# Altium project MB1168.PrjPCB (part 1 of 2)
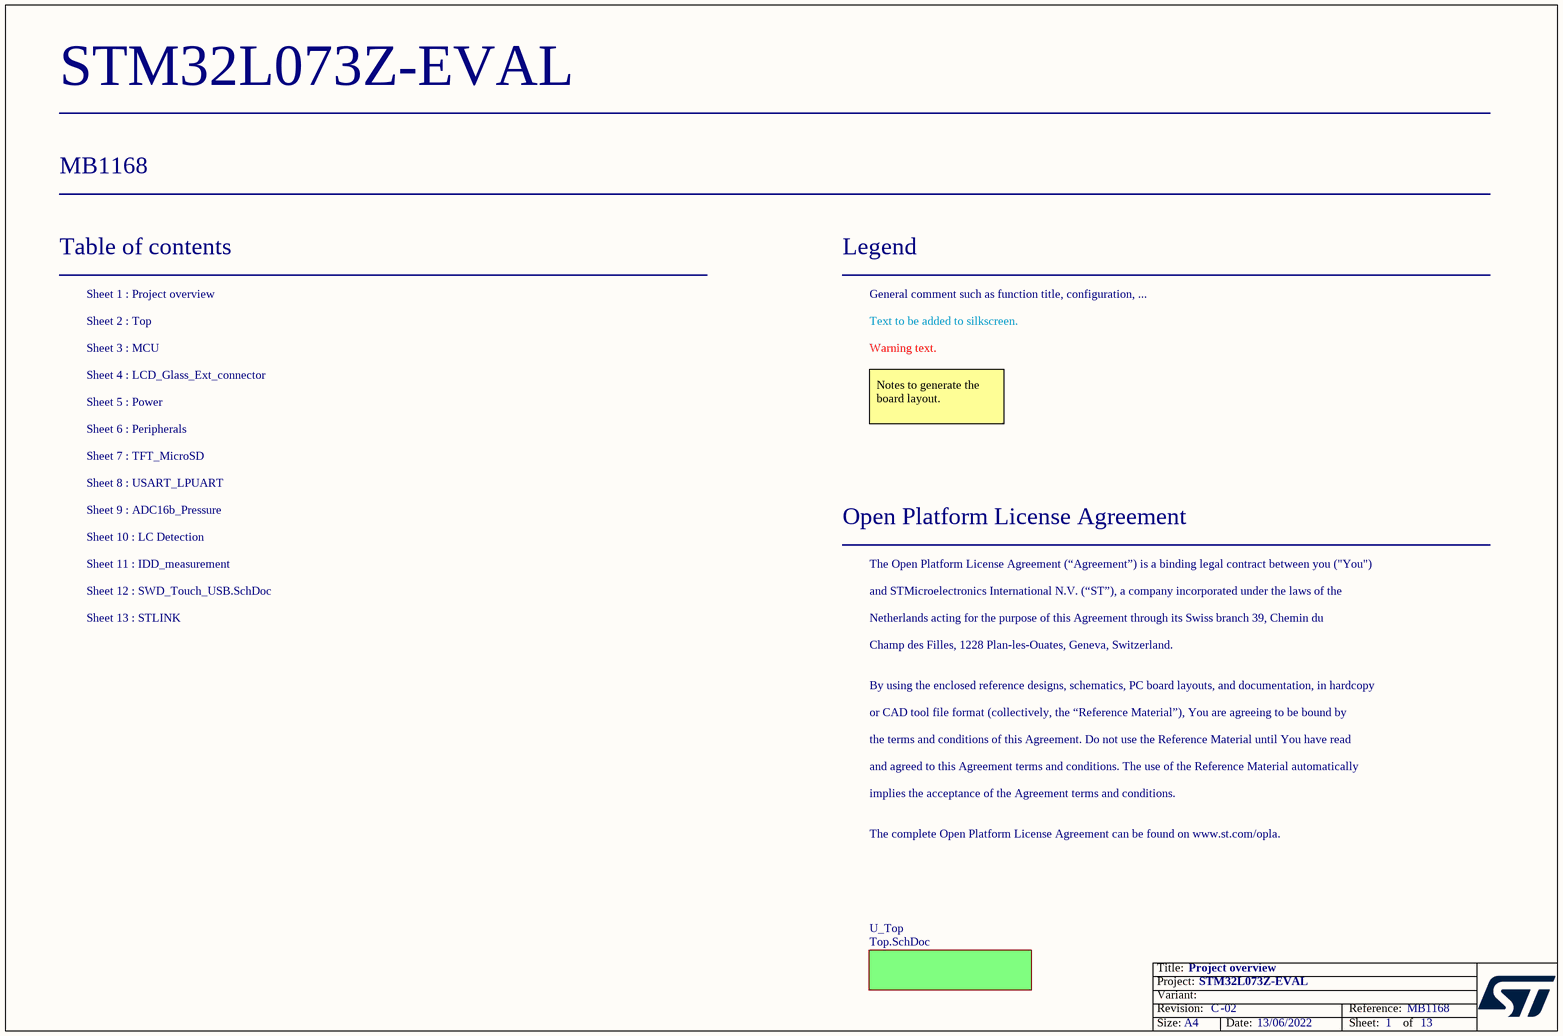
[diagram p0: Project_Overview.SchDoc]
Board_Assembly_Revision: 02; Board_Document_Date: 13/06/2022; Board_Name: STM32L073Z-EVAL; Board_PCB_Revision: C; Board_Reference: MB1168
6 sheets, 267 parts. Net scope: flat (ports and power ports of the same name join across sheets).
Sheets:
  Project_Overview.SchDoc
    U_Top = Top.SchDoc
      U_MCU = MCU.SchDoc
      U_IDD_measurement = IDD_measurement.SchDoc
      U_Power = Power.SchDoc
      U_USART_LPUART = USART_LPUART.SchDoc

## Sheet Project_Overview.SchDoc: Project overview
size A4; Date: Not used; ApprovedBy: Not used; CheckedBy: Not used; Author: Not used; CompanyName: STMicroelectronics; DrawnBy: Not used; Engineer: Not used; Organization: Not used; Address1: Not used; Address2: Not used; Address3: Not used; Address4: Not used; DocumentNumber: 13; Revision: Not used; SheetNumber: 1; SheetTotal: 13; CurrentTime: Not used; CurrentDate: Not used; Time: Not used; DocumentFullPathAndName: Not used; DocumentName: Not used; ModifiedDate: Not used; ImagePath: Not used; ProjectName: Not used; Application_BuildNumber: Not used

### Sub-sheets
U_Top = Top.SchDoc: no entries

### Notes on the sheet
- STM32L073Z-EVAL
- MB1168
- Table of contents
- Sheet 1 : Project overview
- Legend
- General comment such as function title, configuration, ...
- Sheet 2 : Top
- Sheet 3 : MCU
- Sheet 4 : LCD_Glass_Ext_connector
- Text to be added to silkscreen.
- Warning text.
- Sheet 6 : Peripherals
- Sheet 5 : Power
- Notes to generate the board layout.
- Sheet 7 : TFT_MicroSD
- Sheet 8 : USART_LPUART
- Sheet 9 : ADC16b_Pressure
- Sheet 10 : LC Detection
- Sheet 11 : IDD_measurement
- Open Platform License Agreement
- The Open Platform License Agreement (“Agreement”) is a binding legal contract between you ("You")
- Sheet 12 : SWD_Touch_USB.SchDoc
- Sheet 13 : STLINK
- and STMicroelectronics International N.V. (“ST”), a company incorporated under the laws of the
- Netherlands acting for the purpose of this Agreement through its Swiss branch 39, Chemin du
- Champ des Filles, 1228 Plan-les-Ouates, Geneva, Switzerland.
- By using the enclosed reference designs, schematics, PC board layouts, and documentation, in hardcopy
- or CAD tool file format (collectively, the “Reference Material”), You are agreeing to be bound by
- the terms and conditions of this Agreement. Do not use the Reference Material until You have read
- and agreed to this Agreement terms and conditions. The use of the Reference Material automatically
- implies the acceptance of the Agreement terms and conditions.
- The complete Open Platform License Agreement can be found on www.st.com/opla.
- Title:
- Project:
- Size:
- Revision:
- Variant:
- A4
- -
- Date:
- Reference:
- Sheet:
- of

## Sheet Top.SchDoc: Top
size A3; Project: STM32L073Z-EVAL; Date: Not used; ApprovedBy: Not used; CheckedBy: Not used; Author: Not used; CompanyName: STMicroelectronics; DrawnBy: Not used; Engineer: Not used; Organization: Not used; Address1: Not used; Address2: Not used; Address3: Not used; Address4: Not used; DocumentNumber: 1; Revision: Not used; SheetNumber: 2; SheetTotal: 13; CurrentTime: Not used; CurrentDate: Not used; Time: Not used; DocumentFullPathAndName: Not used; DocumentName: Not used; ModifiedDate: Not used; ImagePath: Not used; ProjectName: Not used; Application_BuildNumber: Not used
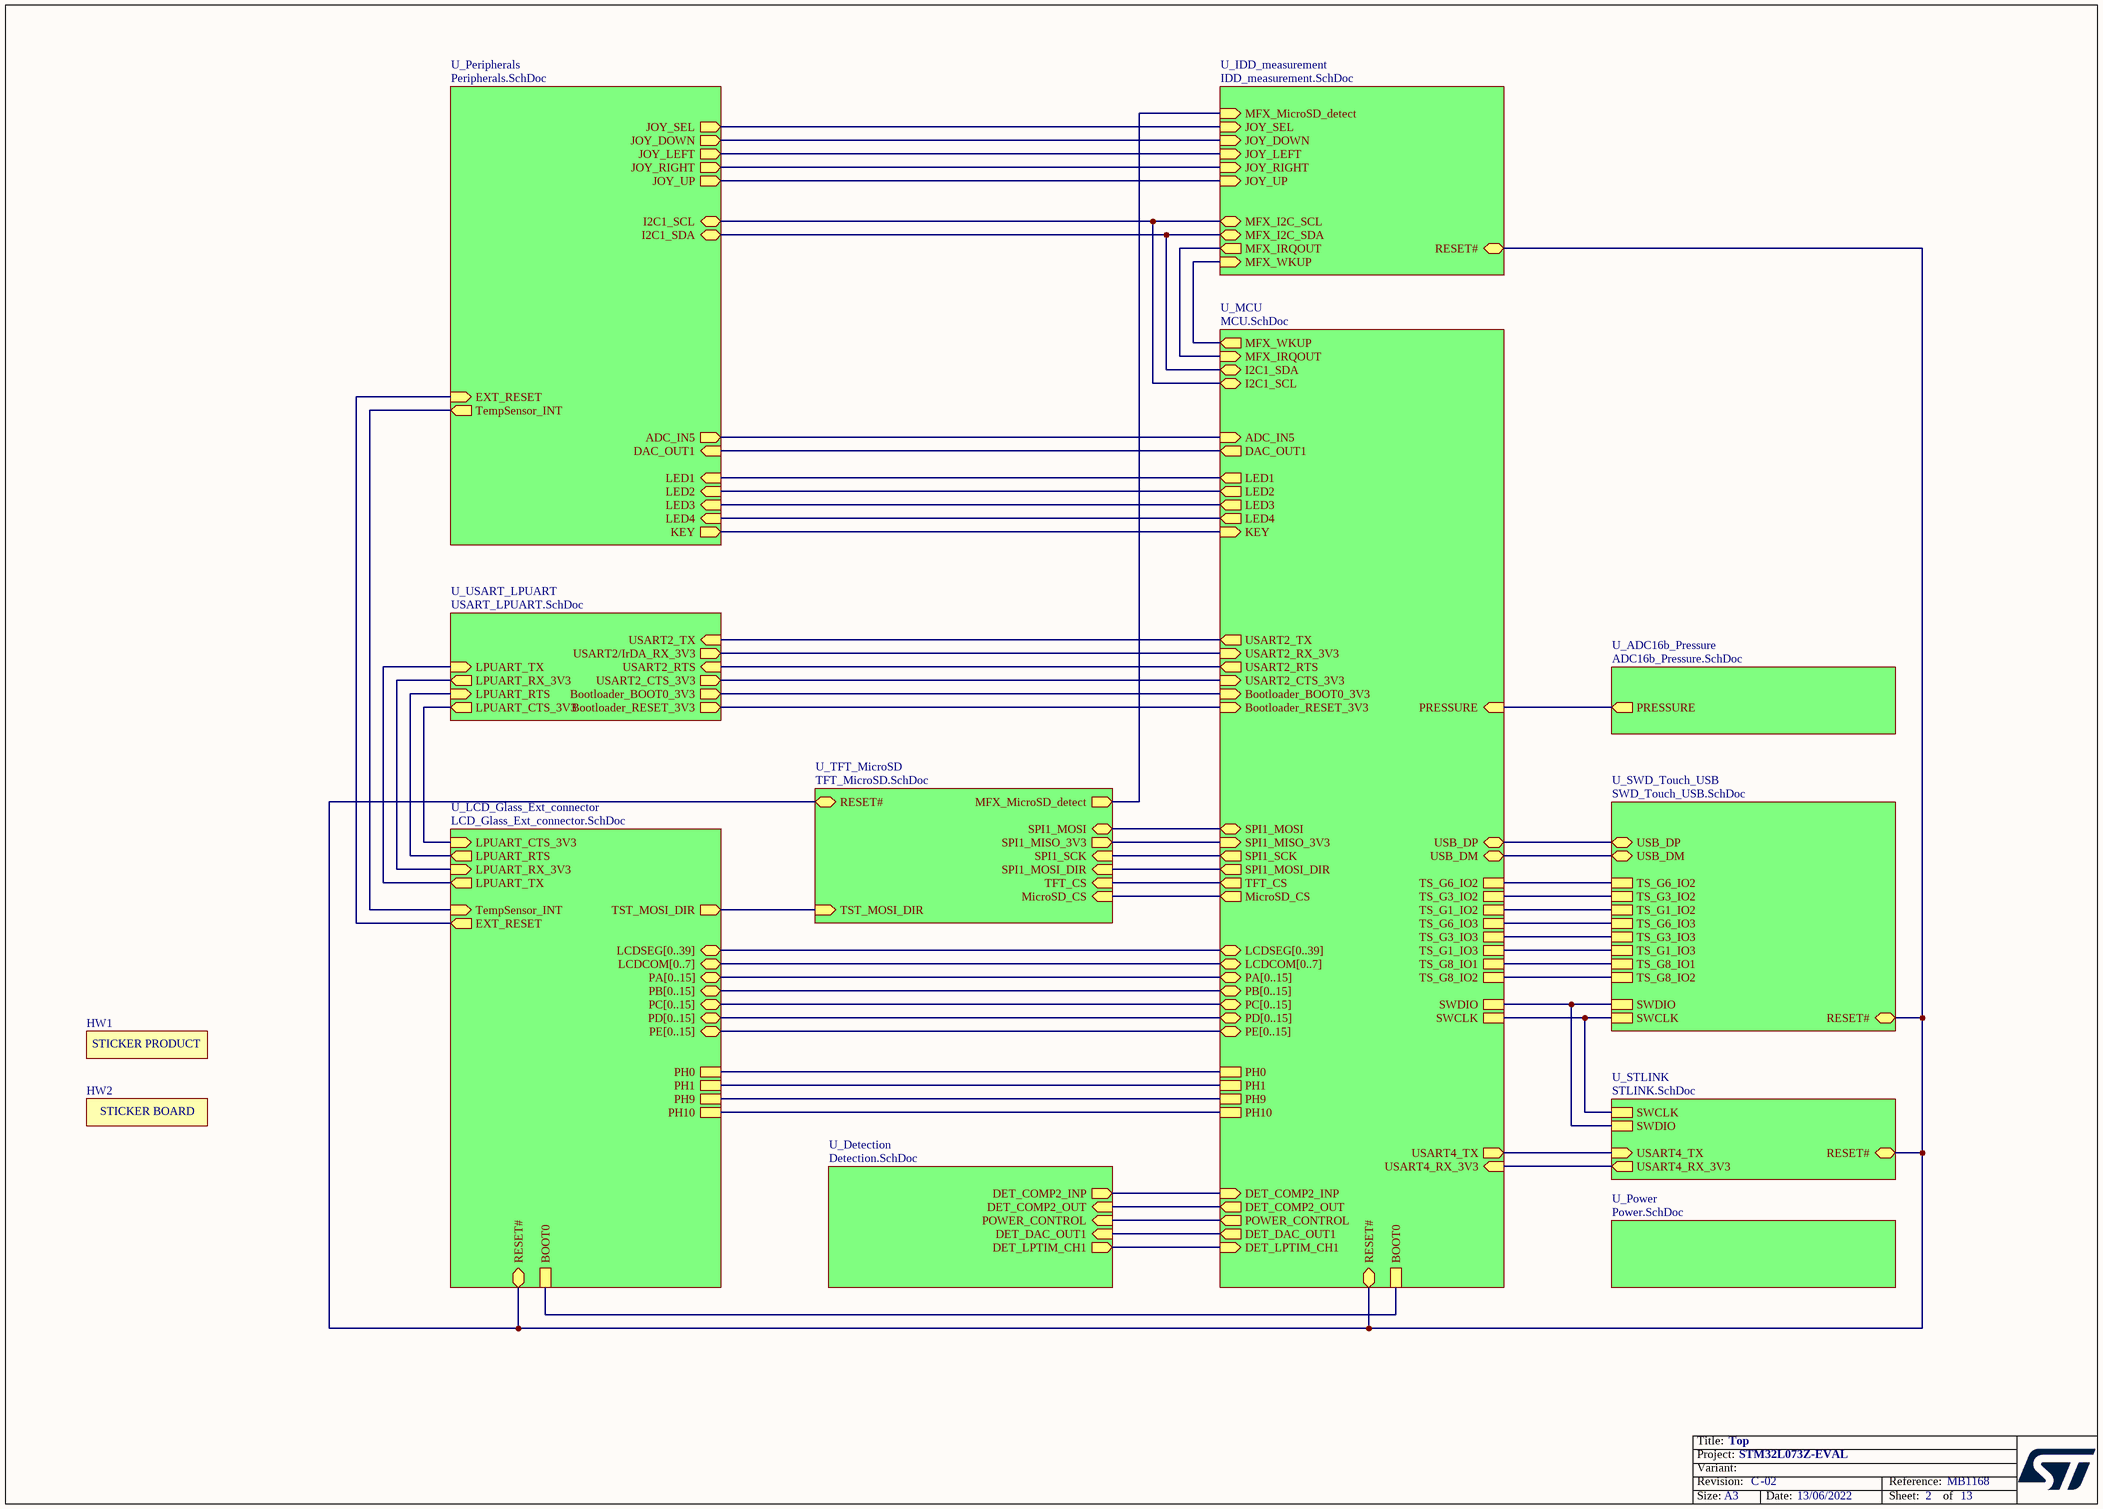
[diagram p1: Top.SchDoc]

### Parts
HW1  STICKER_PRODUCT  (value not drawn)  (no BOM)
HW2  STICKER_BOARD  (value not drawn)  (no BOM)

### Sub-sheets
U_ADC16b_Pressure = ADC16b_Pressure.SchDoc (file not in this document): PRESSURE (out)
U_Detection = Detection.SchDoc (file not in this document): DET_COMP2_INP (out), DET_COMP2_OUT (in), DET_DAC_OUT1 (in), POWER_CONTROL (in), DET_LPTIM_CH1 (out)
U_IDD_measurement = IDD_measurement.SchDoc: MFX_IRQOUT (out), JOY_SEL (in), JOY_DOWN (in), JOY_LEFT (in), JOY_RIGHT (in), JOY_UP (in), MFX_WKUP (in), MFX_MicroSD_detect (in), RESET# (bidir), MFX_I2C_SDA (bidir), MFX_I2C_SCL (bidir)
U_LCD_Glass_Ext_connector = LCD_Glass_Ext_connector.SchDoc (file not in this document): LCDSEG[0..39] (bidir), LCDCOM[0..7] (bidir), LPUART_RX_3V3 (in), LPUART_TX (out), LPUART_CTS_3V3 (in), LPUART_RTS (out), TST_MOSI_DIR (out), TempSensor_INT (in), EXT_RESET (out), PA[0..15] (bidir), PB[0..15] (bidir), PC[0..15] (bidir), PD[0..15] (bidir), PE[0..15] (bidir), RESET# (bidir), PH1, PH0, BOOT0, PH10, PH9
U_MCU = MCU.SchDoc: I2C1_SDA (bidir), I2C1_SCL (bidir), MFX_IRQOUT (in), Bootloader_BOOT0_3V3 (in), Bootloader_RESET_3V3 (in), BOOT0, USART2_RX_3V3 (in), USART2_CTS_3V3 (in), USART2_TX (out), USART2_RTS (out), SPI1_SCK (out), SPI1_MOSI (bidir), MicroSD_CS (out), TFT_CS (out), KEY (in), LED4 (out), LED3 (out), LED1 (out), LED2 (out), USART4_RX_3V3 (in), USART4_TX (out), PRESSURE (in), TS_G1_IO2, TS_G1_IO3, DAC_OUT1 (out), TS_G3_IO2, TS_G3_IO3, TS_G6_IO2, TS_G6_IO3, ADC_IN5 (in), USB_DM (bidir), USB_DP (bidir), SWDIO, SWCLK, SPI1_MISO_3V3 (in), DET_DAC_OUT1 (out), SPI1_MOSI_DIR (out), LCDSEG[0..39] (bidir), LCDCOM[0..7] (bidir), PA[0..15] (bidir), PB[0..15] (bidir), PC[0..15] (bidir), PD[0..15] (bidir), PE[0..15] (bidir), RESET# (bidir), PH1, PH0, PH10, PH9, MFX_WKUP (out), TS_G8_IO1, TS_G8_IO2, DET_COMP2_INP (in), POWER_CONTROL (out), DET_COMP2_OUT (out), DET_LPTIM_CH1 (in)
U_Peripherals = Peripherals.SchDoc (file not in this document): I2C1_SDA (bidir), TempSensor_INT (out), EXT_RESET (in), JOY_SEL (out), JOY_DOWN (out), JOY_LEFT (out), JOY_RIGHT (out), JOY_UP (out), DAC_OUT1 (in), ADC_IN5 (out), KEY (out), LED4 (in), LED3 (in), LED1 (in), LED2 (in), I2C1_SCL (bidir)
U_Power = Power.SchDoc: no entries
U_STLINK = STLINK.SchDoc (file not in this document): USART4_RX_3V3 (out), USART4_TX (in), SWDIO, SWCLK, RESET# (bidir)
U_SWD_Touch_USB = SWD_Touch_USB.SchDoc (file not in this document): RESET# (bidir), SWDIO, SWCLK, USB_DM (bidir), USB_DP (bidir), TS_G1_IO2, TS_G6_IO2, TS_G3_IO2, TS_G6_IO3, TS_G3_IO3, TS_G1_IO3, TS_G8_IO1, TS_G8_IO2
U_TFT_MicroSD = TFT_MicroSD.SchDoc (file not in this document): MFX_MicroSD_detect (out), RESET# (bidir), SPI1_MISO_3V3 (out), SPI1_MOSI (bidir), SPI1_MOSI_DIR (in), SPI1_SCK (in), MicroSD_CS (in), TFT_CS (in), TST_MOSI_DIR (in)
U_USART_LPUART = USART_LPUART.SchDoc: USART2/IrDA_RX_3V3 (out), Bootloader_BOOT0_3V3 (out), Bootloader_RESET_3V3 (out), USART2_CTS_3V3 (out), USART2_TX (in), USART2_RTS (in), LPUART_RX_3V3 (out), LPUART_CTS_3V3 (out), LPUART_TX (in), LPUART_RTS (in)

### Nets
(unnamed): sheet U_MCU/I2C1_SDA, sheet U_IDD_measurement/MFX_I2C_SDA, sheet U_Peripherals/I2C1_SDA
(unnamed): sheet U_MCU/I2C1_SCL, sheet U_IDD_measurement/MFX_I2C_SCL, sheet U_Peripherals/I2C1_SCL
(unnamed): sheet U_MCU/MFX_IRQOUT, sheet U_IDD_measurement/MFX_IRQOUT
(unnamed): sheet U_MCU/Bootloader_BOOT0_3V3, sheet U_USART_LPUART/Bootloader_BOOT0_3V3
(unnamed): sheet U_MCU/Bootloader_RESET_3V3, sheet U_USART_LPUART/Bootloader_RESET_3V3
(unnamed): sheet U_MCU/BOOT0, sheet U_LCD_Glass_Ext_connector/BOOT0
(unnamed): sheet U_MCU/USART2_RX_3V3, sheet U_USART_LPUART/USART2/IrDA_RX_3V3
(unnamed): sheet U_MCU/USART2_CTS_3V3, sheet U_USART_LPUART/USART2_CTS_3V3
(unnamed): sheet U_MCU/USART2_TX, sheet U_USART_LPUART/USART2_TX
(unnamed): sheet U_MCU/USART2_RTS, sheet U_USART_LPUART/USART2_RTS
(unnamed): sheet U_MCU/SPI1_SCK, sheet U_TFT_MicroSD/SPI1_SCK
(unnamed): sheet U_MCU/SPI1_MOSI, sheet U_TFT_MicroSD/SPI1_MOSI
(unnamed): sheet U_MCU/MicroSD_CS, sheet U_TFT_MicroSD/MicroSD_CS
(unnamed): sheet U_MCU/TFT_CS, sheet U_TFT_MicroSD/TFT_CS
(unnamed): sheet U_MCU/KEY, sheet U_Peripherals/KEY
(unnamed): sheet U_MCU/LED4, sheet U_Peripherals/LED4
(unnamed): sheet U_MCU/LED3, sheet U_Peripherals/LED3
(unnamed): sheet U_MCU/LED1, sheet U_Peripherals/LED1
(unnamed): sheet U_MCU/LED2, sheet U_Peripherals/LED2
(unnamed): sheet U_MCU/USART4_RX_3V3, sheet U_STLINK/USART4_RX_3V3
(unnamed): sheet U_MCU/USART4_TX, sheet U_STLINK/USART4_TX
(unnamed): sheet U_MCU/PRESSURE, sheet U_ADC16b_Pressure/PRESSURE
(unnamed): sheet U_MCU/TS_G1_IO2, sheet U_SWD_Touch_USB/TS_G1_IO2
(unnamed): sheet U_MCU/TS_G1_IO3, sheet U_SWD_Touch_USB/TS_G1_IO3
(unnamed): sheet U_MCU/DAC_OUT1, sheet U_Peripherals/DAC_OUT1
(unnamed): sheet U_MCU/TS_G3_IO2, sheet U_SWD_Touch_USB/TS_G3_IO2
(unnamed): sheet U_MCU/TS_G3_IO3, sheet U_SWD_Touch_USB/TS_G3_IO3
(unnamed): sheet U_MCU/TS_G6_IO2, sheet U_SWD_Touch_USB/TS_G6_IO2
(unnamed): sheet U_MCU/TS_G6_IO3, sheet U_SWD_Touch_USB/TS_G6_IO3
(unnamed): sheet U_MCU/ADC_IN5, sheet U_Peripherals/ADC_IN5
(unnamed): sheet U_MCU/USB_DM, sheet U_SWD_Touch_USB/USB_DM
(unnamed): sheet U_MCU/USB_DP, sheet U_SWD_Touch_USB/USB_DP
(unnamed): sheet U_MCU/SWDIO, sheet U_STLINK/SWDIO, sheet U_SWD_Touch_USB/SWDIO
(unnamed): sheet U_MCU/SWCLK, sheet U_STLINK/SWCLK, sheet U_SWD_Touch_USB/SWCLK
(unnamed): sheet U_MCU/SPI1_MISO_3V3, sheet U_TFT_MicroSD/SPI1_MISO_3V3
(unnamed): sheet U_MCU/DET_DAC_OUT1, sheet U_Detection/DET_DAC_OUT1
(unnamed): sheet U_MCU/SPI1_MOSI_DIR, sheet U_TFT_MicroSD/SPI1_MOSI_DIR
(unnamed): sheet U_MCU/RESET#, sheet U_IDD_measurement/RESET#, sheet U_LCD_Glass_Ext_connector/RESET#, sheet U_STLINK/RESET#, sheet U_TFT_MicroSD/RESET#, sheet U_SWD_Touch_USB/RESET#
(unnamed): sheet U_MCU/PH1, sheet U_LCD_Glass_Ext_connector/PH1
(unnamed): sheet U_MCU/PH0, sheet U_LCD_Glass_Ext_connector/PH0
(unnamed): sheet U_MCU/PH10, sheet U_LCD_Glass_Ext_connector/PH10
(unnamed): sheet U_MCU/PH9, sheet U_LCD_Glass_Ext_connector/PH9
(unnamed): sheet U_MCU/MFX_WKUP, sheet U_IDD_measurement/MFX_WKUP
(unnamed): sheet U_MCU/TS_G8_IO1, sheet U_SWD_Touch_USB/TS_G8_IO1
(unnamed): sheet U_MCU/TS_G8_IO2, sheet U_SWD_Touch_USB/TS_G8_IO2
(unnamed): sheet U_MCU/DET_COMP2_INP, sheet U_Detection/DET_COMP2_INP
(unnamed): sheet U_MCU/POWER_CONTROL, sheet U_Detection/POWER_CONTROL
(unnamed): sheet U_MCU/DET_COMP2_OUT, sheet U_Detection/DET_COMP2_OUT
(unnamed): sheet U_MCU/DET_LPTIM_CH1, sheet U_Detection/DET_LPTIM_CH1
(unnamed): sheet U_IDD_measurement/JOY_SEL, sheet U_Peripherals/JOY_SEL
(unnamed): sheet U_IDD_measurement/JOY_DOWN, sheet U_Peripherals/JOY_DOWN
(unnamed): sheet U_IDD_measurement/JOY_LEFT, sheet U_Peripherals/JOY_LEFT
(unnamed): sheet U_IDD_measurement/JOY_RIGHT, sheet U_Peripherals/JOY_RIGHT
(unnamed): sheet U_IDD_measurement/JOY_UP, sheet U_Peripherals/JOY_UP
(unnamed): sheet U_IDD_measurement/MFX_MicroSD_detect, sheet U_TFT_MicroSD/MFX_MicroSD_detect
(unnamed): sheet U_LCD_Glass_Ext_connector/LPUART_RX_3V3, sheet U_USART_LPUART/LPUART_RX_3V3
(unnamed): sheet U_LCD_Glass_Ext_connector/LPUART_TX, sheet U_USART_LPUART/LPUART_TX
(unnamed): sheet U_LCD_Glass_Ext_connector/LPUART_CTS_3V3, sheet U_USART_LPUART/LPUART_CTS_3V3
(unnamed): sheet U_LCD_Glass_Ext_connector/LPUART_RTS, sheet U_USART_LPUART/LPUART_RTS
(unnamed): sheet U_LCD_Glass_Ext_connector/TST_MOSI_DIR, sheet U_TFT_MicroSD/TST_MOSI_DIR
(unnamed): sheet U_LCD_Glass_Ext_connector/TempSensor_INT, sheet U_Peripherals/TempSensor_INT
(unnamed): sheet U_LCD_Glass_Ext_connector/EXT_RESET, sheet U_Peripherals/EXT_RESET

### Buses and harness runs
bus sheet U_LCD_Glass_Ext_connector/LCDCOM[0..7] = sheet U_MCU/LCDCOM[0..7]
bus sheet U_LCD_Glass_Ext_connector/LCDSEG[0..39] = sheet U_MCU/LCDSEG[0..39]
bus sheet U_LCD_Glass_Ext_connector/PA[0..15] = sheet U_MCU/PA[0..15]
bus sheet U_LCD_Glass_Ext_connector/PB[0..15] = sheet U_MCU/PB[0..15]
bus sheet U_LCD_Glass_Ext_connector/PC[0..15] = sheet U_MCU/PC[0..15]
bus sheet U_LCD_Glass_Ext_connector/PD[0..15] = sheet U_MCU/PD[0..15]
bus sheet U_LCD_Glass_Ext_connector/PE[0..15] = sheet U_MCU/PE[0..15]

### Notes on the sheet
- Title:
- Project:
- Size:
- Revision:
- Variant:
- A3
- -
- Date:
- Reference:
- Sheet:
- of
- (in symbol STICKER_BOARD) STICKER BOARD
- (in symbol STICKER_PRODUCT) STICKER PRODUCT

## Sheet MCU.SchDoc: MCU
size A3; Project: STM32L073Z-EVAL; PageSetup: Record=PageOptions|CenterHorizontal=True|CenterVertical=True|PrintScale=1.00|XCorrection=1.00|YCorrection=1.00|PrintKind=1|BorderSize=5000000|LeftOffset=0|BottomOffset=0|Orientation=2|PaperLength=1000|PaperWidth=1000|Scale=100|PaperSource=7|PrintQuality=-4|MediaType=1|DitherType=10|PaperKind=A3|PrintScaleMode=1; Date: Not used; ApprovedBy: Not used; CheckedBy: Not used; Author: Not used; CompanyName: STMicroelectronics; DrawnBy: Not used; Engineer: Not used; Organization: Not used; Address1: Not used; Address2: Not used; Address3: Not used; Address4: Not used; DocumentNumber: 2; Revision: Not used; SheetNumber: 3; SheetTotal: 13; CurrentTime: Not used; CurrentDate: Not used; Time: Not used; DocumentFullPathAndName: Not used; DocumentName: Not used; ModifiedDate: Not used; ImagePath: Not used; ProjectName: Not used; Application_BuildNumber: Not used
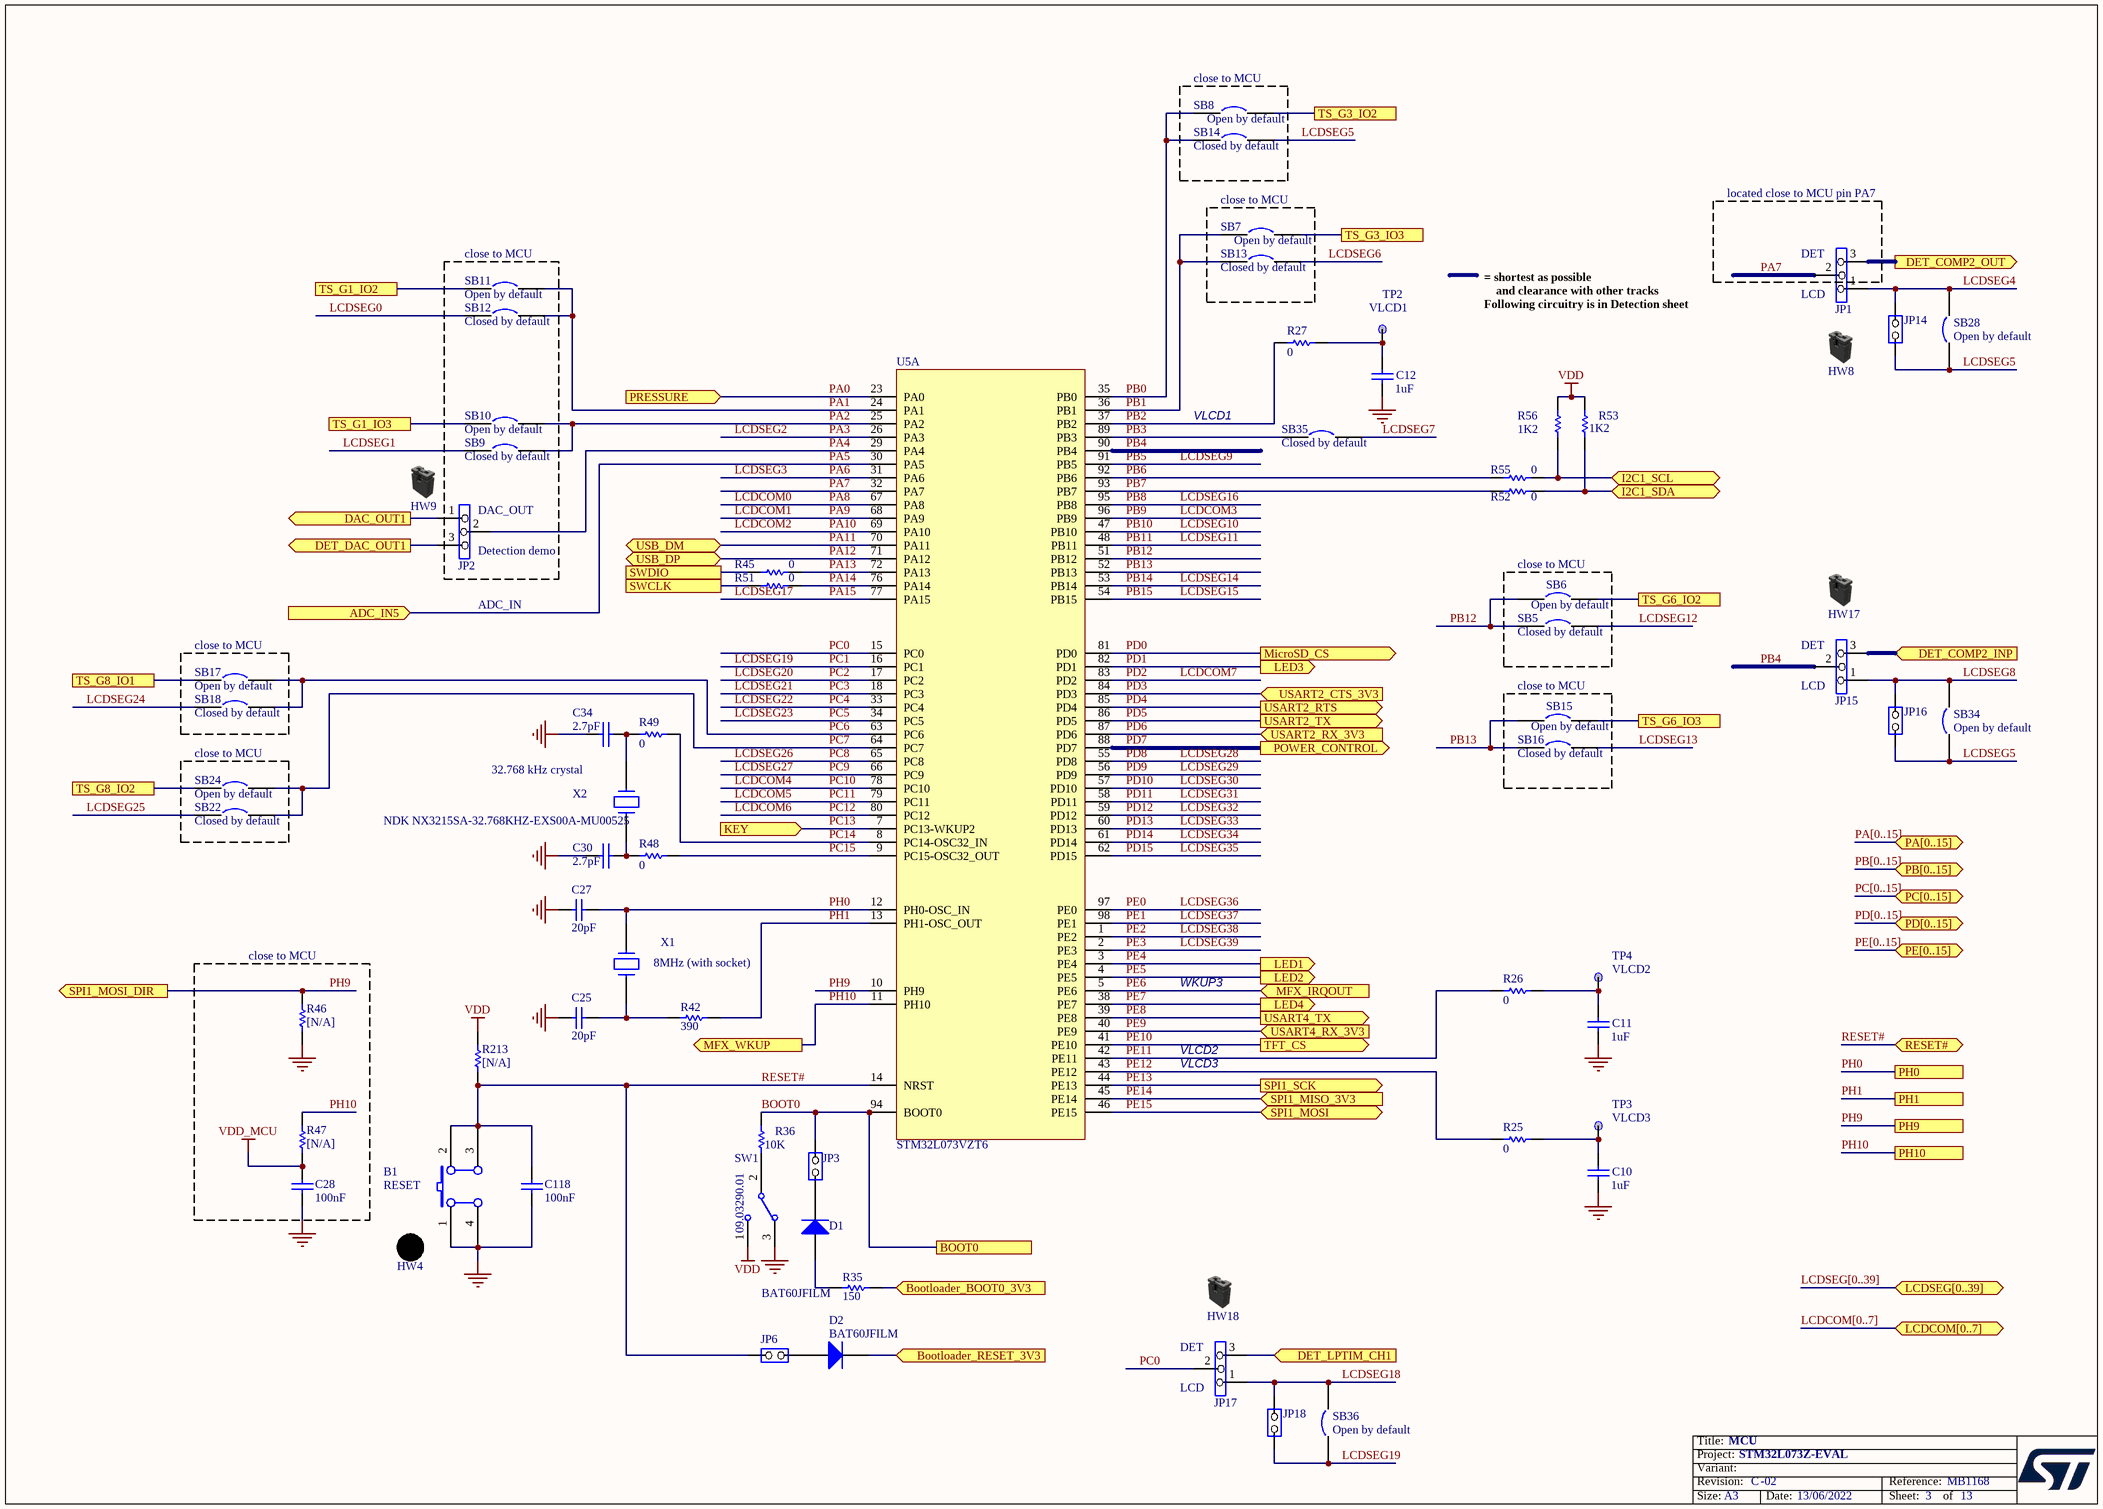
[diagram p2: MCU.SchDoc]

### Parts
B1  RESET  [PB10]
C10  1uF  [0603C]
C11  1uF  [0603C]
C12  1uF  [0603C]
C25  20pF  [0402C]
C27  20pF  [0402C]
C28  100nF  [0402C]
C30  2.7pF  [0603C]
C34  2.7pF  [0603C]
C118  100nF  [0402C]
D1  BAT60JFILM  [SOD-323]
D2  BAT60JFILM  [SOD-323]
HW4  BUTTON_HAT_BLACK  (value not drawn)  (mechanical)
HW8  Shunt Black 2.54mm  (value not drawn)  (mechanical)
HW9  Shunt Black 2.54mm  (value not drawn)  (mechanical)
HW17  Shunt Black 2.54mm  (value not drawn)  (mechanical)
HW18  Shunt Black 2.54mm  (value not drawn)  (mechanical)
JP1  (no value)  [SIP3]
JP2  (no value)  [SIP3]
JP3  (no value)  [SIP2]
JP6  (no value)  [SIP2]
JP14  (no value)  [SIP2]
JP15  (no value)  [SIP3]
JP16  (no value)  [SIP2]
JP17  (no value)  [SIP3]
JP18  (no value)  [SIP2]
R25  0  [0603R]
R26  0  [0603R]
R27  0  [0603R]
R35  150  [0402R]
R36  10K  [0402R]
R42  390  [0603R]
R45  0  [0603R]
R46  [N/A]  [0603R]
R47  [N/A]  [0603R]
R48  0  [0603R]
R49  0  [0603R]
R51  0  [0603R]
R52  0  [0603R]
R53  1K2  [0603R]
R55  0  [0603R]
R56  1K2  [0603R]
R213  [N/A]  [0603R]
SB5  Closed by default  [SB_0603]
SB6  Open by default  [SB_0603]
SB7  Open by default  [SB_0603]
SB8  Open by default  [SB_0603]
SB9  Closed by default  [SB_0603]
SB10  Open by default  [SB_0603]
SB11  Open by default  [SB_0603]
SB12  Closed by default  [SB_0603]
SB13  Closed by default  [SB_0603]
SB14  Closed by default  [SB_0603]
SB15  Open by default  [SB_0603]
SB16  Closed by default  [SB_0603]
SB17  Open by default  [SB_0603]
SB18  Closed by default  [SB_0603]
SB22  Closed by default  [SB_0603]
SB24  Open by default  [SB_0603]
SB28  Open by default  [SB_0603]
SB34  Open by default  [SB_0603]
SB35  Closed by default  [SB_0603]
SB36  Open by default  [SB_0603]
SW1  09.03290.01  [SW1_3TH_2R54_10X2R5]
TP2  Silkscreen: VLCD1  [TP]  (hidden comment: TP)
TP3  Silkscreen: VLCD3  [TP]  (hidden comment: TP)
TP4  Silkscreen: VLCD2  [TP]  (hidden comment: TP)
U5  STM32L073VZT6  [IC149_100_025_B5]  (part A of 2)
X1  8MHz (with socket)  [XTAL_SOCKET]
X2  NDK NX3215SA-32.768KHZ-EXS00A-MU00525  [XTAL_2SM_3R2X1R5]

### Blocks framed on the sheet
close to MCU: SB8 SB14
close to MCU: SB7 SB13
close to MCU: SB5 SB6
close to MCU: SB17 SB18
close to MCU: SB15 SB16
close to MCU: SB22 SB24
close to MCU: C28 R46 R47

### Ports
ADC_IN5 (in), BOOT0, Bootloader_BOOT0_3V3 (in), Bootloader_RESET_3V3 (in), DAC_OUT1 (out), DET_COMP2_INP (in), DET_COMP2_OUT (out), DET_DAC_OUT1 (out), DET_LPTIM_CH1 (in), I2C1_SCL (bidir), I2C1_SDA (bidir), KEY (in), LCDCOM[0..7] (bidir), LCDSEG[0..39] (bidir), LED1 (out), LED2 (out), LED3 (out), LED4 (out), MFX_IRQOUT (in), MFX_WKUP (out), MicroSD_CS (out), PA[0..15] (bidir), PB[0..15] (bidir), PC[0..15] (bidir), PD[0..15] (bidir), PE[0..15] (bidir), PH0, PH1, PH9, PH10, POWER_CONTROL (out), PRESSURE (in), RESET# (bidir), SPI1_MISO_3V3 (in), SPI1_MOSI (bidir), SPI1_MOSI_DIR (out), SPI1_SCK (out), SWCLK, SWDIO, TFT_CS (out), TS_G1_IO2, TS_G1_IO3, TS_G3_IO2, TS_G3_IO3, TS_G6_IO2, TS_G6_IO3, TS_G8_IO1, TS_G8_IO2, USART2_CTS_3V3 (in), USART2_RTS (out), USART2_RX_3V3 (in), USART2_TX (out), USART4_RX_3V3 (in), USART4_TX (out), USB_DM (bidir), USB_DP (bidir)

### Nets
GND: B1.1(A0) B1.4(A1) C10.1 C11.1 C12.1 C25.2 C27.2 C28.1 C30.2 C34.2 C118.1 R46.1 SW1.3
VDD: R53.2 R56.2 R213.2 SW1.1
VDD_MCU: C28.2 R47.1
BOOT0: JP3.1(COMMON) R36.1 U5.94(BOOT0) ; port BOOT0
LCDCOM0: U5.67(PA8)  [also labelled PA8]
LCDCOM1: U5.68(PA9)  [also labelled PA9]
LCDCOM2: U5.69(PA10)  [also labelled PA10]
LCDCOM3: U5.96(PB9)  [also labelled PB9]
LCDCOM4: U5.78(PC10)  [also labelled PC10]
LCDCOM5: U5.79(PC11)  [also labelled PC11]
LCDCOM6: U5.80(PC12)  [also labelled PC12]
LCDCOM7: U5.83(PD2)  [also labelled PD2]
LCDSEG0: SB12.1
LCDSEG1: SB9.1
LCDSEG2: U5.26(PA3)  [also labelled PA3]
LCDSEG3: U5.31(PA6)  [also labelled PA6]
LCDSEG4: JP1.1 JP14.2(NO) SB28.2
LCDSEG5: JP14.1(COMMON) JP16.1(COMMON) SB14.2 SB28.1 SB34.1
LCDSEG6: SB13.2
LCDSEG7: SB35.2
LCDSEG8: JP15.1 JP16.2(NO) SB34.2
LCDSEG9: U5.91(PB5)  [also labelled PB5]
LCDSEG10: U5.47(PB10)  [also labelled PB10]
LCDSEG11: U5.48(PB11)  [also labelled PB11]
LCDSEG12: SB5.2
LCDSEG13: SB16.2
LCDSEG14: U5.53(PB14)  [also labelled PB14]
LCDSEG15: U5.54(PB15)  [also labelled PB15]
LCDSEG16: U5.95(PB8)  [also labelled PB8]
LCDSEG17: U5.77(PA15)  [also labelled PA15]
LCDSEG18: JP17.1 JP18.2(NO) SB36.2
LCDSEG19: JP18.1(COMMON) SB36.1 U5.16(PC1)  [also labelled PC1]
LCDSEG20: U5.17(PC2)  [also labelled PC2]
LCDSEG21: U5.18(PC3)  [also labelled PC3]
LCDSEG22: U5.33(PC4)  [also labelled PC4]
LCDSEG23: U5.34(PC5)  [also labelled PC5]
LCDSEG24: SB18.1
LCDSEG25: SB22.1
LCDSEG26: U5.65(PC8)  [also labelled PC8]
LCDSEG27: U5.66(PC9)  [also labelled PC9]
LCDSEG28: U5.55(PD8)  [also labelled PD8]
LCDSEG29: U5.56(PD9)  [also labelled PD9]
LCDSEG30: U5.57(PD10)  [also labelled PD10]
LCDSEG31: U5.58(PD11)  [also labelled PD11]
LCDSEG32: U5.59(PD12)  [also labelled PD12]
LCDSEG33: U5.60(PD13)  [also labelled PD13]
LCDSEG34: U5.61(PD14)  [also labelled PD14]
LCDSEG35: U5.62(PD15)  [also labelled PD15]
LCDSEG36: U5.97(PE0)  [also labelled PE0]
LCDSEG37: U5.98(PE1)  [also labelled PE1]
LCDSEG38: U5.1(PE2)  [also labelled PE2]
LCDSEG39: U5.2(PE3)  [also labelled PE3]
PA0: U5.23(PA0) ; port PRESSURE
PA1: SB11.2 SB12.2 U5.24(PA1)
PA2: SB9.2 SB10.2 U5.25(PA2)
PA4: JP2.2 U5.29(PA4)
PA5: U5.30(PA5) ; port ADC_IN5
PA7: JP1.2 U5.32(PA7)
PA11: U5.70(PA11) ; port USB_DM
PA12: U5.71(PA12) ; port USB_DP
PA13: R45.2 U5.72(PA13)
PA14: R51.2 U5.76(PA14)
PB0: SB8.1 SB14.1 U5.35(PB0)
PB1: SB7.1 SB13.1 U5.36(PB1)
PB2: R27.1 U5.37(PB2)
PB3: SB35.1 U5.89(PB3)
PB4: JP15.2 U5.90(PB4)
PB6: R55.1 U5.92(PB6)
PB7: R52.1 U5.93(PB7)
PB12: SB5.1 SB6.1 U5.51(PB12)
PB13: SB15.1 SB16.1 U5.52(PB13)
PC0: JP17.2 U5.15(PC0)
PC6: SB17.2 SB18.2 U5.63(PC6)
PC7: SB22.2 SB24.2 U5.64(PC7)
PC13: U5.7(PC13-WKUP2) ; port KEY
PC14: R49.2 U5.8(PC14-OSC32_IN)
PC15: R48.2 U5.9(PC15-OSC32_OUT)
PD0: U5.81(PD0) ; port MicroSD_CS
PD1: U5.82(PD1) ; port LED3
PD3: U5.84(PD3) ; port USART2_CTS_3V3
PD4: U5.85(PD4) ; port USART2_RTS
PD5: U5.86(PD5) ; port USART2_TX
PD6: U5.87(PD6) ; port USART2_RX_3V3
PD7: U5.88(PD7) ; port POWER_CONTROL
PE4: U5.3(PE4) ; port LED1
PE5: U5.4(PE5) ; port LED2
PE6: U5.5(PE6) ; port MFX_IRQOUT
PE7: U5.38(PE7) ; port LED4
PE8: U5.39(PE8) ; port USART4_TX
PE9: U5.40(PE9) ; port USART4_RX_3V3
PE10: U5.41(PE10) ; port TFT_CS
PE11: R26.1 U5.42(PE11)
PE12: R25.1 U5.43(PE12)
PE13: U5.44(PE13) ; port SPI1_SCK
PE14: U5.45(PE14) ; port SPI1_MISO_3V3
PE15: U5.46(PE15) ; port SPI1_MOSI
PH0: C27.1 U5.12(PH0-OSC_IN) X1.2 ; port PH0
PH1: R42.1 U5.13(PH1-OSC_OUT) ; port PH1
PH9: R46.2 U5.10(PH9) ; port SPI1_MOSI_DIR, port PH9
PH10: R47.2 U5.11(PH10) ; port PH10, port MFX_WKUP
RESET#: B1.2(B0) B1.3(B1) C118.2 JP6.1(COMMON) R213.1 U5.14(NRST) ; port RESET#
NetC10_2: C10.2 R25.2 TP3.1
NetC11_2: C11.2 R26.2 TP4.1
NetC12_2: C12.2 R27.2 TP2.1
NetC25_1: C25.1 R42.2 X1.1
NetC30_1: C30.1 R48.1 X2.1
NetC34_1: C34.1 R49.1 X2.2
NetD1_1: D1.1(A) R35.1
NetD1_2: D1.2(K) JP3.2(NO)
NetD2_1: D2.1(A) JP6.2(NO)
NetD2_2: D2.2(K) ; port Bootloader_RESET_3V3
NetJP1_3: JP1.3 ; port DET_COMP2_OUT
NetJP2_1: JP2.1 ; port DAC_OUT1
NetJP2_3: JP2.3 ; port DET_DAC_OUT1
NetJP15_3: JP15.3 ; port DET_COMP2_INP
NetJP17_3: JP17.3 ; port DET_LPTIM_CH1
NetR35_2: R35.2 ; port Bootloader_BOOT0_3V3
NetR36_2: R36.2 SW1.2
NetR45_1: R45.1 ; port SWDIO
NetR51_1: R51.1 ; port SWCLK
NetR52_2: R52.2 R53.1 ; port I2C1_SDA
NetR55_2: R55.2 R56.1 ; port I2C1_SCL
NetSB6_2: SB6.2 ; port TS_G6_IO2
NetSB7_2: SB7.2 ; port TS_G3_IO3
NetSB8_2: SB8.2 ; port TS_G3_IO2
NetSB10_1: SB10.1 ; port TS_G1_IO3
NetSB11_1: SB11.1 ; port TS_G1_IO2
NetSB15_2: SB15.2 ; port TS_G6_IO3
NetSB17_1: SB17.1 ; port TS_G8_IO1
NetSB24_1: SB24.1 ; port TS_G8_IO2

### Buses and harness runs
bus LCDCOM[0..7] = port LCDCOM[0..7]
bus LCDSEG[0..39] = port LCDSEG[0..39]
bus PA[0..15] = port PA[0..15]
bus PB[0..15] = port PB[0..15]
bus PC[0..15] = port PC[0..15]
bus PD[0..15] = port PD[0..15]
bus PE[0..15] = port PE[0..15]

### Notes on the sheet
- located close to MCU pin PA7
- (near SB11) close to MCU
- LCD
- (near JP1) DET
- VLCD1
- (near JP2) DAC_OUT
- (near JP2) Detection demo
- ADC_IN
- (near JP15) DET
- (near JP15) LCD
- 32.768 kHz crystal
- WKUP3
- VLCD2
- VLCD3
- (near JP17) LCD
- (near JP17) DET
- Title:
- Project:
- Size:
- Revision:
- Variant:
- A3
- -
- Date:
- Reference:
- Sheet:
- of

### Library data of the parts
B1 = SW PUSHBUTTON: SE PUSHBUTTON; Ordered by: Subcon; Comments: no comment; Assembly: Black; Silkscreen: Reset; ECCN_US/EU: n/a
C10-C12 = CAP: Capacitor; Value: 100nF; Ordered by: Subcon; Published: 8-Jun-2000; Revision: July-2002: Re-released for DXP Platform.; Publisher: Altium Limited; ECCN_US/EU: n/a
C25 C27 C28 C118 = CAP: Capacitor; Value: 100pF; Ordered by: Subcon; Published: 8-Jun-2000; Revision: July-2002: Re-released for DXP Platform.; Publisher: Altium Limited; ECCN_US/EU: n/a
C30 C34 = CAP: Capacitor; Ordered by: Subcon; ECCN_US/EU: n/a
D1 D2 = Diode: Default Diode; Code - JEDEC: DO-214-AB; Ordered by: ST; ECCN_US/EU: EAR99/NEC; Ref St: 9151097; Published: 8-Jun-2000; Revision: July-2002: Re-released for DXP Platform.; Publisher: Altium Limited; Manuf_1: ST; Manuf_Part_1: BAT60JFILM
JP1 JP15 JP17 = Jumper3: Ordered by: Subcon; Silkscreen: 1,2: LCD / 2,3: DET; Assembly: 1-2 closed (LCD); ECCN_US/EU: n/a
JP2 = Jumper3: Ordered by: Subcon; Silkscreen: 1,2: DAC_OUT / 2,3: Det; Assembly: 1-2 closed (DAC); ECCN_US/EU: n/a
JP3 = JP2: Ordered by: Subcon; Silkscreen: BL_Boot0; Assembly: opened; ECCN_US/EU: n/a
JP6 = JP2: Ordered by: Subcon; Silkscreen: BL_RST; Assembly: opened; ECCN_US/EU: n/a
JP14 JP16 JP18 = JP2: Ordered by: Subcon; Assembly: opened; ECCN_US/EU: n/a
R25-R27 R42 R45 R48 R49 R51-R53 R55 R56 = Res1: Resistor; Value: 1K; Ordered by: Subcon; Published: 8-Jun-2000; Revision: July-2002: Re-released for DXP Platform.; Publisher: Altium Limited; ECCN_US/EU: n/a
R35 R36 = res1: Resistor; Value: 1K; Ordered by: Subcon; Published: 8-Jun-2000; Revision: July-2002: Re-released for DXP Platform.; Publisher: Altium Limited; ECCN_US/EU: n/a
R46 R47 R213 = res1: Resistor; Value: 1K; Ordered by: Subcon; Fitted: NO; Published: 8-Jun-2000; Revision: July-2002: Re-released for DXP Platform.; Publisher: Altium Limited; ECCN_US/EU: n/a
SB5 SB9 SB12-SB14 SB16 SB18 SB22 SB35 = Circuit Breaker: Ordered by: Subcon; Comments: Solder bridge; Published: 24-Mar-1999; Revision: July-2002: Re-released for DXP Platform.; Publisher: Altium Limited; ECCN_US/EU: n/a
SB6-SB8 SB10 SB11 SB15 SB17 SB24 SB28 SB34 SB36 = Circuit Breaker: Ordered by: Subcon; Comments: Solder bridge; Fitted: NO; Published: 24-Mar-1999; Revision: July-2002: Re-released for DXP Platform.; Publisher: Altium Limited; ECCN_US/EU: n/a
SW1 = SW-SPDT: SPDT Subminiature Toggle Switch, Right Angle Mounting, Vertical Actuation; Revision 1: Jul-2002: Re-released for DXP Platform.; Revision 2: 17-Dec-2003: Schematic revised, PCB Footprint replaced.; Ordered by: Subcon; Silkscreen: 0 <--> 1   0=Flash, 1 = Sys mem; Published: 24-Mar-1999; Datasheet: Latest Revision: 05-Dec-2000; Publisher: Altium Limited; ECCN_US/EU: n/a
TP2-TP4 = TP: Ordered by: Subcon; Fitted: NO; ECCN_US/EU: n/a
U5 = BigNemo: Manuf_Part_1: FG=32L073VZT6$x3 cut 2.0 marking "B"; Ordered by: ST; ECCN_US/EU: 3A991A2/NEC; Ref St: 9175165; Manuf_1: ST
X1 = CRYSTAL: Ordered by: Subcon; Assembly: with socket; ECCN_US/EU: n/a
X2 = CRYSTAL_32K: Crystal; Ordered by: Subcon; Manuf_1: NDK; Manuf_Part_1: NX3215SA-32.768KHZ-EXS00A-MU00525; ECCN_US/EU: n/a

## Sheet IDD_measurement.SchDoc: IDD_measurement
size A3; Project: STM32L073Z-EVAL; Date: Not used; ApprovedBy: Not used; CheckedBy: Not used; Author: Not used; CompanyName: STMicroelectronics; DrawnBy: Not used; Engineer: Not used; Organization: Not used; Address1: Not used; Address2: Not used; Address3: Not used; Address4: Not used; DocumentNumber: 10; Revision: Not used; SheetNumber: 11; SheetTotal: 13; CurrentTime: Not used; CurrentDate: Not used; Time: Not used; DocumentFullPathAndName: Not used; DocumentName: Not used; ModifiedDate: Not used; ImagePath: Not used; ProjectName: Not used; Application_BuildNumber: Not used
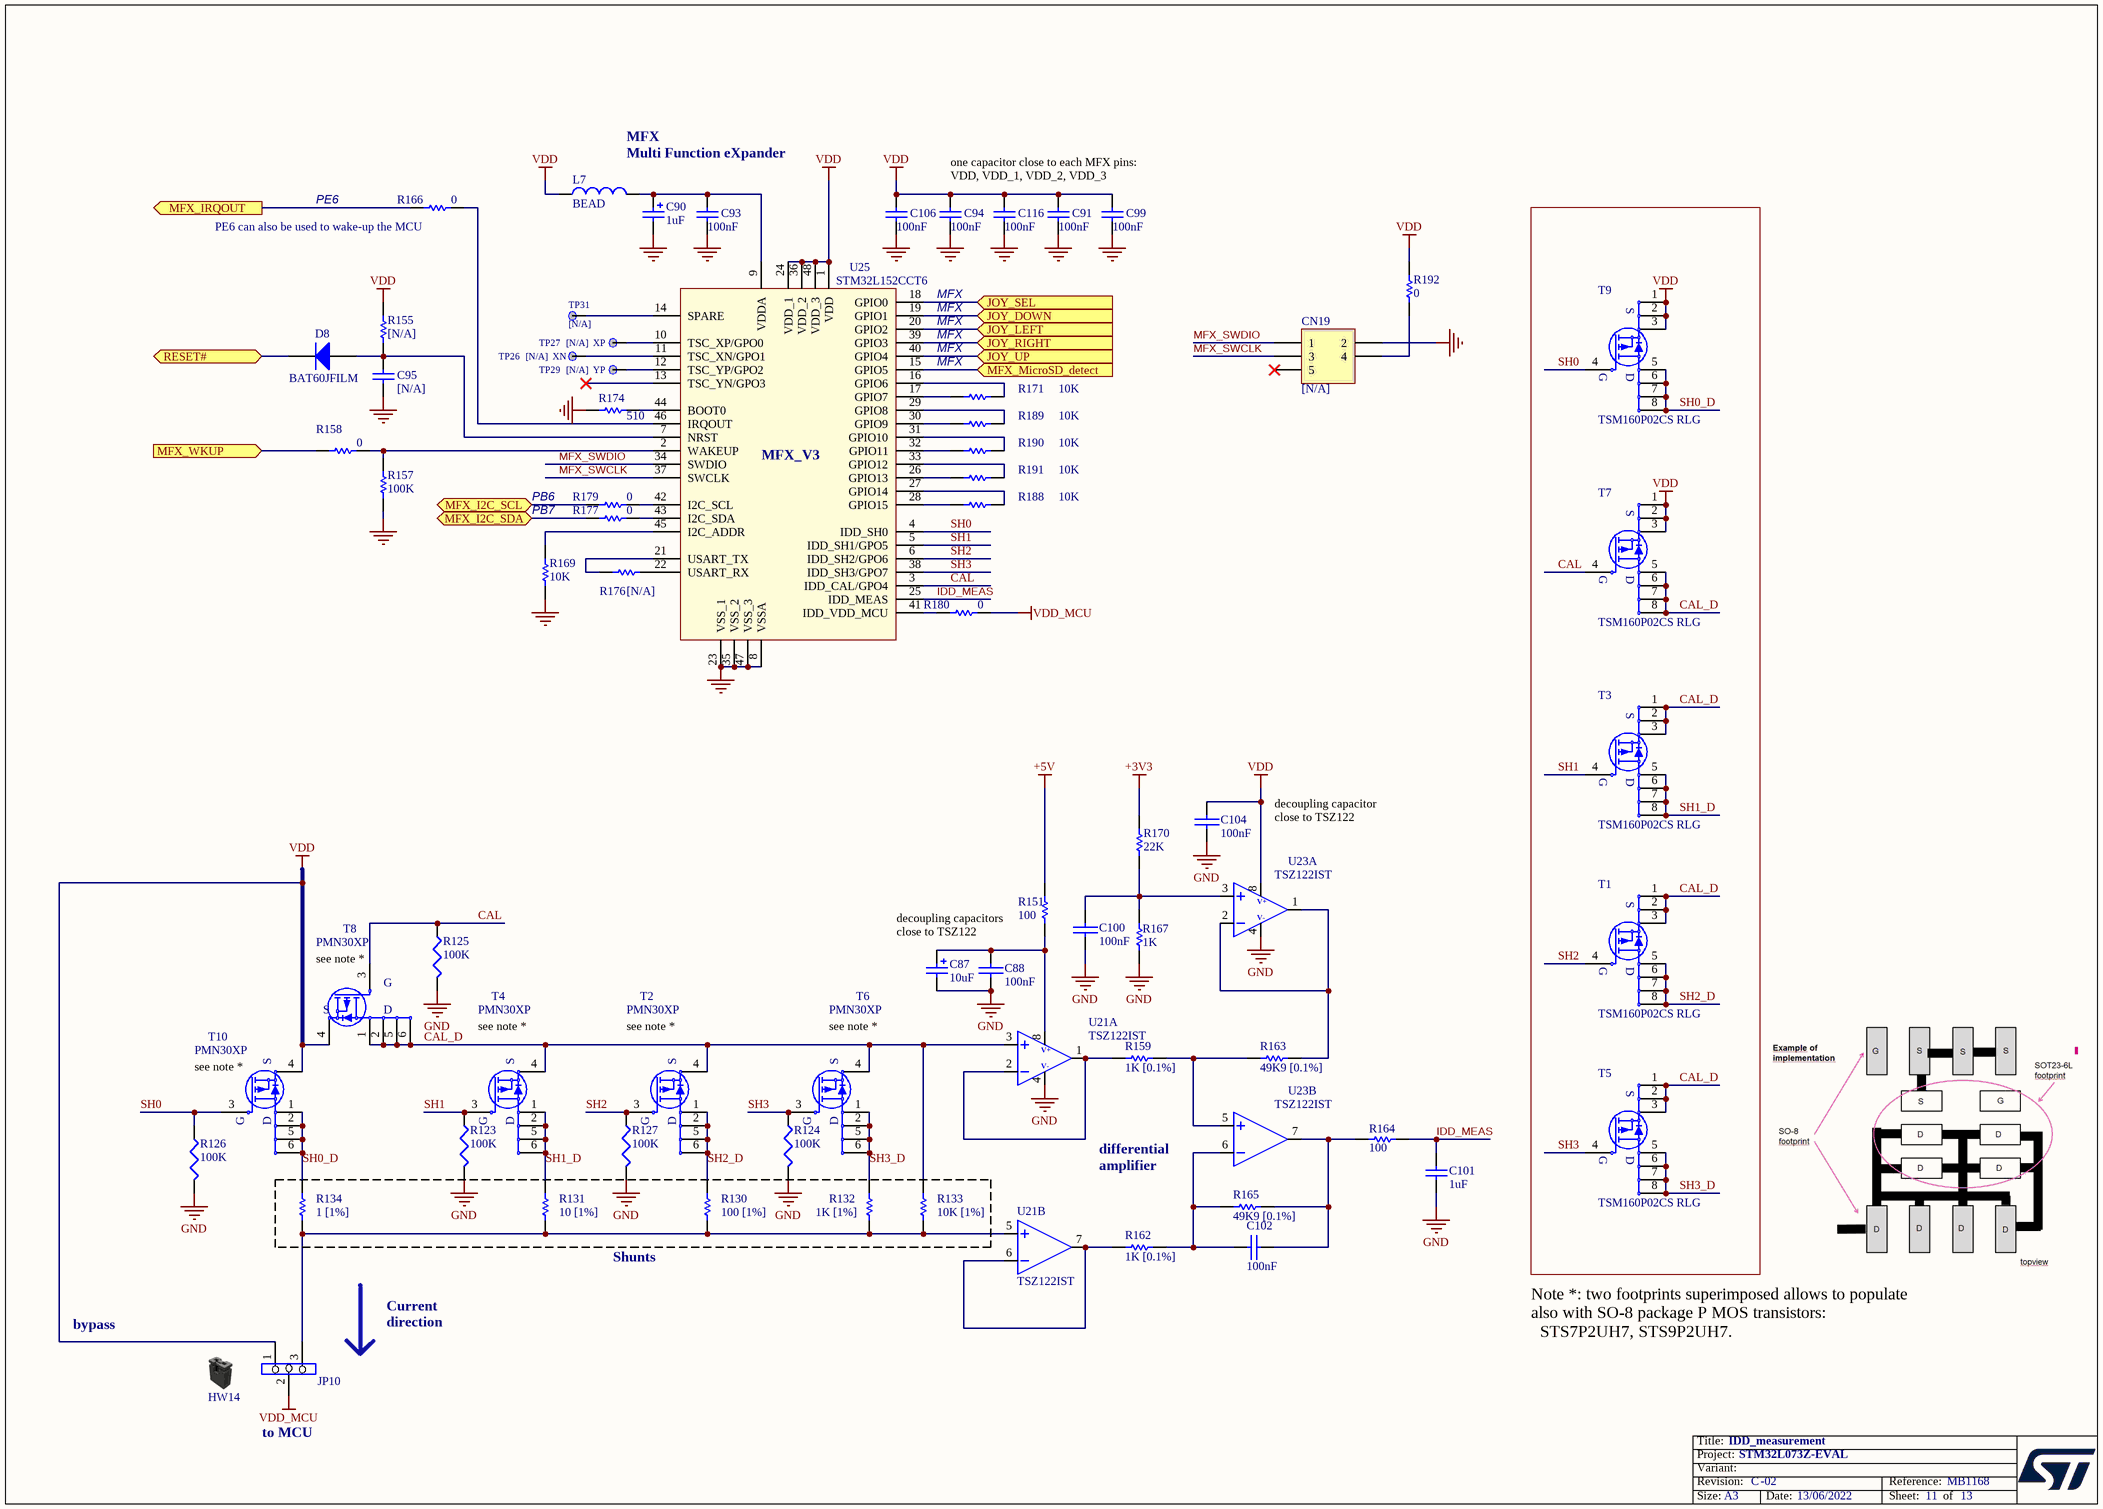
[diagram p3: IDD_measurement.SchDoc]

### Parts
C87  10uF  [TAN-A]
C88  100nF  [0402C]
C90  1uF  [TAN-A]
C91  100nF  [0402C]
C93  100nF  [0402C]
C94  100nF  [0402C]
C95  [N/A]  [0603C]
C99  100nF  [0402C]
C100  100nF  [0402C]
C101  1uF  [0603C]
C102  100nF  [0402C]
C104  100nF  [0402C]
C106  100nF  [0402C]
C116  100nF  [0402C]
CN19  [N/A]  [HDR_2X3-1_2R54-6]
D8  BAT60JFILM  [SOD-323]
HW14  Shunt Black 2.54mm  (value not drawn)  (mechanical)
JP10  (no value)  [SIP3]
L7  BEAD  [0603L]
R123  100K  [0402R]
R124  100K  [0402R]
R125  100K  [0402R]
R126  100K  [0402R]
R127  100K  [0402R]
R130  100 [1%]  [0603R]
R131  10 [1%]  [0603R]
R132  1K [1%]  [0603R]
R133  10K [1%]  [0603R]
R134  1 [1%]  [0603R]
R151  100  [0402R]
R155  [N/A]  [0603R]
R157  100K  [0402R]
R158  0  [0603R]
R159  1K [0.1%]  [0603R]
R162  1K [0.1%]  [0603R]
R163  49K9 [0.1%]  [0603R]
R164  100  [0402R]
R165  49K9 [0.1%]  [0603R]
R166  0  [0603R]
R167  1K  [0402R]
R169  10K  [0603R]
R170  22K  [0603R]
R171  10K  [0603R]
R174  510  [0402R]
R176  [N/A]  [0603R]
R177  0  [0603R]
R179  0  [0603R]
R180  0  [0603R]
R188  10K  [0603R]
R189  10K  [0603R]
R190  10K  [0603R]
R191  10K  [0603R]
R192  0  [0603R]
T1  TSM160P02CS RLG  [SOIC8_1R27_4R9X6]
T2  PMN30XP  [SOT23-6L]
T3  TSM160P02CS RLG  [SOIC8_1R27_4R9X6]
T4  PMN30XP  [SOT23-6L]
T5  TSM160P02CS RLG  [SOIC8_1R27_4R9X6]
T6  PMN30XP  [SOT23-6L]
T7  TSM160P02CS RLG  [SOIC8_1R27_4R9X6]
T8  PMN30XP  [SOT23-6L]
T9  TSM160P02CS RLG  [SOIC8_1R27_4R9X6]
T10  PMN30XP  [SOT23-6L]
TP26  [N/A]  Silkscreen: XN  [TP]
TP27  [N/A]  Silkscreen: XP  [TP]
TP29  [N/A]  Silkscreen: YP  [TP]
TP31  [N/A]  [TP]
U21  TSZ122IST  [MSOP8_0R65_3X4R9]  (parts A,B of 2)
U23  TSZ122IST  [MSOP8_0R65_3X4R9]  (parts A,B of 2)
U25  STM32L152CCT6  [LQFP48_0R5_9X9]

### Ports
JOY_DOWN (in), JOY_LEFT (in), JOY_RIGHT (in), JOY_SEL (in), JOY_UP (in), MFX_I2C_SCL (bidir), MFX_I2C_SDA (bidir), MFX_IRQOUT (out), MFX_MicroSD_detect (in), MFX_WKUP (in), RESET# (bidir)

### Nets
+3V3: R170.1
+5V: R151.1
GND: C87.2 C88.2 C90.2 C91.1 C93.1 C94.1 C95.1 C99.1 C100.2 C101.1 C104.2 C106.1 C116.2 CN19.2 R123.2 R124.2 R125.2 R126.2 R127.2 R157.2 R167.2 R169.1 R174.2 U21.4 U23.4 U25.8(VSSA) U25.23(VSS_1) U25.35(VSS_2) U25.47(VSS_3)
VDD: C91.2 C94.2 C99.2 C104.1 C106.2 C116.1 JP10.1 L7.1 R155.1 R192.2 T7.1(S) T7.2(S) T7.3(S) T8.4(S) T9.1(S) T9.2(S) T9.3(S) T10.4(S) U23.8 U25.1(VDD) U25.24(VDD_1) U25.36(VDD_2) U25.48(VDD_3)
VDD_MCU: JP10.2 R180.2
CAL: R125.1 T7.4(G) T8.3(G) U25.3(IDD_CAL/GPO4)
CAL_D: R133.2 T1.1(S) T1.2(S) T1.3(S) T2.4(S) T3.1(S) T3.2(S) T3.3(S) T4.4(S) T5.1(S) T5.2(S) T5.3(S) T6.4(S) T7.5(D) T7.6(D) T7.7(D) T7.8(D) T8.1(S) T8.2(S) T8.5(D) T8.6(D) U21.3
IDD_MEAS: C101.2 R164.1 U25.25(IDD_MEAS)
MFX_SWCLK: CN19.3 U25.37(SWCLK)
MFX_SWDIO: CN19.1 U25.34(SWDIO)
PE6: R166.1 ; port MFX_IRQOUT
PH10: R158.1 ; port MFX_WKUP
RESET#: D8.2(K) ; port RESET#
SH0: R126.1 T9.4(G) T10.3(G) U25.4(IDD_SH0)
SH0_D: R134.2 T9.5(D) T9.6(D) T9.7(D) T9.8(D) T10.1(S) T10.2(S) T10.5(D) T10.6(D)
SH1: R123.1 T3.4(G) T4.3(G) U25.5(IDD_SH1/GPO5)
SH1_D: R131.2 T3.5(D) T3.6(D) T3.7(D) T3.8(D) T4.1(S) T4.2(S) T4.5(D) T4.6(D)
SH2: R127.1 T1.4(G) T2.3(G) U25.6(IDD_SH2/GPO6)
SH2_D: R130.2 T1.5(D) T1.6(D) T1.7(D) T1.8(D) T2.1(S) T2.2(S) T2.5(D) T2.6(D)
SH3: R124.1 T5.4(G) T6.3(G) U25.38(IDD_SH3/GPO7)
SH3_D: R132.2 T5.5(D) T5.6(D) T5.7(D) T5.8(D) T6.1(S) T6.2(S) T6.5(D) T6.6(D)
NetC87_1: C87.1 C88.1 R151.2 U21.8
NetC90_1: C90.1 C93.2 L7.2 U25.9(VDDA)
NetC95_2: C95.2 D8.1(A) R155.2 U25.7(NRST)
NetC100_1: C100.1 R167.1 R170.2 U23.3
NetC102_1: C102.1 R162.2 R165.1 U23.6
NetC102_2: C102.2 R164.2 R165.2 U23.7
NetCN19_4: CN19.4 R192.1
NetJP10_3: JP10.3 R130.1 R131.1 R132.1 R133.1 R134.1 U21.5
NetR157_1: R157.1 R158.2 U25.2(WAKEUP)
NetR159_1: R159.1 U21.1 U21.2
NetR159_2: R159.2 R163.1 U23.5
NetR162_1: R162.1 U21.6 U21.7
NetR163_2: R163.2 U23.1 U23.2
NetR166_2: R166.2 U25.46(IRQOUT)
NetR169_2: R169.2 U25.45(I2C_ADDR)
NetR171_1: R171.1 U25.17(GPIO7)
NetR171_2: R171.2 U25.16(GPIO6)
NetR174_1: R174.1 U25.44(BOOT0)
NetR176_1: R176.1 U25.21(USART_TX)
NetR176_2: R176.2 U25.22(USART_RX)
NetR177_1: R177.1 ; port MFX_I2C_SDA
NetR177_2: R177.2 U25.43(I2C_SDA)
NetR179_1: R179.1 ; port MFX_I2C_SCL
NetR179_2: R179.2 U25.42(I2C_SCL)
NetR180_1: R180.1 U25.41(IDD_VDD_MCU)
NetR188_1: R188.1 U25.28(GPIO15)
NetR188_2: R188.2 U25.27(GPIO14)
NetR189_1: R189.1 U25.30(GPIO9)
NetR189_2: R189.2 U25.29(GPIO8)
NetR190_1: R190.1 U25.32(GPIO11)
NetR190_2: R190.2 U25.31(GPIO10)
NetR191_1: R191.1 U25.26(GPIO13)
NetR191_2: R191.2 U25.33(GPIO12)
NetTP26_1: TP26.1 U25.11(TSC_XN/GPO1)
NetTP27_1: TP27.1 U25.10(TSC_XP/GPO0)
NetTP29_1: TP29.1 U25.12(TSC_YP/GPO2)
NetTP31_1: TP31.1 U25.14(SPARE)
NetU25_15: U25.15(GPIO5) ; port MFX_MicroSD_detect
NetU25_18: U25.18(GPIO0) ; port JOY_SEL
NetU25_19: U25.19(GPIO1) ; port JOY_DOWN
NetU25_20: U25.20(GPIO2) ; port JOY_LEFT
NetU25_39: U25.39(GPIO3) ; port JOY_RIGHT
NetU25_40: U25.40(GPIO4) ; port JOY_UP

Not connected (* = marked no-connect by the designer): CN19 5*; U25 13(TSC_YN/GPO3)*

### Notes on the sheet
- MFX
  Multi Function eXpander
- (near R166) PE6 can also be used to wake-up the MCU
- PE6
- one capacitor close to each MFX pins: VDD, VDD_1, VDD_2, VDD_3
- (near U25) MFX
- MFX
- PB6
- PB7
- decoupling capacitor
  close to TSZ122
- (near T8) see note *
- decoupling capacitors
  close to TSZ122
- (near T4) see note *
- (near T2) see note *
- (near T6) see note *
- (near T10) see note *
- differential
  amplifier
- (near R130) Shunts
- bypass
- Current direction
- Note *: two footprints superimposed allows to populate also with SO-8 package P MOS transistors:
  STS7P2UH7, STS9P2UH7.
- (near JP10) to MCU
- Title:
- Project:
- Size:
- Revision:
- Variant:
- A3
- -
- Date:
- Reference:
- Sheet:
- of
- (in symbol AOP-8PINS, part A) V+; V-

### Library data of the parts
C87 = Cap Pol1: Polarized Capacitor (Radial); Ordered by: Subcon; Published: 8-Jun-2000; Revision: July-2002: Re-released for DXP Platform.; Publisher: Altium Limited; Value: 10uF; ECCN_US/EU: n/a
C88 C100 C102 C104 = CAP: Ordered by: Subcon; ECCN_US/EU: n/a
C90 = Cap_1uF_POL_10%_TANA: Polarized Capacitor; Manuf_Part_1: TC212A105K016; Manuf_1: AVX; Ordered by: Subcon; Revision: July-2002: Re-released for DXP Platform.; Value: 1uF; Order: *; Distrib: *; ECCN_US/EU: n/a
C91 C93 C94 C99 C106 C116 = Cap_100nF_X7R_10%_0402: Capacitor,100nF,16V,X7R,10%,0402,YAGEO; Manuf_Part_1: CC0402KRX7R7BB104; Ordered by: Subcon; Revision: July-2002: Re-released for DXP Platform.; Value: 100nF; Order: CC0402KRX7R7BB104; Manuf_1: YAGEO; ECCN_US/EU: n/a
C95 = cap: Capacitor; Value: 100pF; Ordered by: Subcon; Fitted: NO; Published: 8-Jun-2000; Revision: July-2002: Re-released for DXP Platform.; Publisher: Altium Limited; ECCN_US/EU: n/a
C101 = CAP: as C10 on sheet MCU; Published: 8-Jun-2000; Revision: July-2002: Re-released for DXP Platform.; Publisher: Altium Limited; ECCN_US/EU: n/a
CN19 = Header 3X2: Header, 3-Pin, Dual row; Ordered by: Subcon; Fitted: NO; Revision: 17-Jul-2002: Re-released for DXP Platform.; Publisher: Altium Limited; ECCN_US/EU: n/a
D8 = Diode: as D1 on sheet MCU; Published: 8-Jun-2000; Revision: July-2002: Re-released for DXP Platform.; Publisher: Altium Limited; Manuf_1: ST; Manuf_Part_1: BAT60JFILM
JP10 = Jumper3: Ordered by: Subcon; Silkscreen: 1,2: VDD / 2,3: IDD; Assembly: 2-3 (IDD); ECCN_US/EU: n/a
L7 = BEAD_600R_350MA_0603: Bead,600R,350mA,0603; Manuf_Part_1: FCM1608KF-601T05; Manuf_2: Wurth Elektronik; Manuf_Part_2: 742863160; Manuf_1: Tai-tech; Value: 100uH; Comment_1: bead,30R,5A,0603,MPZ1608S300A,TDK; Ordered by: Subcon; Revision: July-2002: Re-released for DXP Platform.; Order: *; ECCN_US/EU: n/a
R123-R127 = RES1: Resistor; Ordered by: Subcon; ECCN_US/EU: n/a
R130 R131 R133 R134 R151 R163 R165 R169-R171 R188-R191 = res1: Resistor; Value: 1K; Ordered by: Subcon; Published: 8-Jun-2000; Revision: July-2002: Re-released for DXP Platform.; Publisher: Altium Limited; ECCN_US/EU: n/a
R132 R159 R162 = res1: Resistor; Ordered by: Subcon; Published: 8-Jun-2000; Revision: July-2002: Re-released for DXP Platform.; Publisher: Altium Limited; Value: 1K; ECCN_US/EU: n/a
R155 = Res1: Resistor; Value: 1K; Ordered by: Subcon; Fitted: NO; Published: 8-Jun-2000; Revision: July-2002: Re-released for DXP Platform.; Publisher: Altium Limited; ECCN_US/EU: n/a
R157 R174 = Resistor_ST: Resistor 0402 / 0603 / 0805; Value: 10K; Ordered by: Subcon; ECCN_US/EU: n/a
R158 R164 R166 R177 R179 R180 R192 = Res1: Resistor; Value: 1K; Ordered by: Subcon; Published: 8-Jun-2000; Revision: July-2002: Re-released for DXP Platform.; Publisher: Altium Limited; ECCN_US/EU: n/a
R167 = Res1: Resistor; Ordered by: Subcon; Published: 8-Jun-2000; Revision: July-2002: Re-released for DXP Platform.; Publisher: Altium Limited; Value: 1K; ECCN_US/EU: n/a
R176 = res1: as R46 on sheet MCU; Published: 8-Jun-2000; Revision: July-2002: Re-released for DXP Platform.; Publisher: Altium Limited; ECCN_US/EU: n/a
T1 = STS7P2UH7: STripFET VII Power MOSFET, P-CHANNEL 20V - 0.023 - 7A - SO-8; Manuf_Part_1: STS9P2UH7; Manuf_1: ST; Manuf_2: STM; Ref St: 9153052; ECCN_US/EU: EAR99/NEC; Comments: exclusive with T2; Order: STS9P2UH7; Distrib: ST; Provided: ST; Ordered by: ST; Manuf_Part_2: STS7P2UH7
T2 = STT7P2UH7: STripFET VII DeepGATE Power MOSFET, P-CHANNEL 20 V, 0.0146, 7 A - SOT23-6L; Manuf_1: ST; Ref St: 9153048; ECCN_US/EU: EAR99/NEC; Comments: exclusive with T1; Fitted: NO; Manuf_Part_1: STT7P2UH7; Order: STT7P2UH7; Distrib: ST; Provided: ST; Ordered by: ST
T3 = STS7P2UH7: STripFET VII Power MOSFET, P-CHANNEL 20V - 0.023 - 7A - SO-8; Manuf_Part_1: STS9P2UH7; Manuf_1: ST; Manuf_2: STM; Ref St: 9153052; ECCN_US/EU: EAR99/NEC; Comments: exclusive with T4; Order: STS9P2UH7; Distrib: ST; Provided: ST; Ordered by: ST; Manuf_Part_2: STS7P2UH7
T4 = STT7P2UH7: STripFET VII DeepGATE Power MOSFET, P-CHANNEL 20 V, 0.0146, 7 A - SOT23-6L; Manuf_1: ST; Ref St: 9153048; ECCN_US/EU: EAR99/NEC; Comments: exclusive with T3; Fitted: NO; Manuf_Part_1: STT7P2UH7; Order: STT7P2UH7; Distrib: ST; Provided: ST; Ordered by: ST
T5 = STS7P2UH7: STripFET VII Power MOSFET, P-CHANNEL 20V - 0.023 - 7A - SO-8; Manuf_Part_1: STS9P2UH7; Manuf_1: ST; Manuf_2: STM; Ref St: 9153052; ECCN_US/EU: EAR99/NEC; Comments: exclusive with T6; Order: STS9P2UH7; Distrib: ST; Provided: ST; Ordered by: ST; Manuf_Part_2: STS7P2UH7
T6 = STT7P2UH7: STripFET VII DeepGATE Power MOSFET, P-CHANNEL 20 V, 0.0146, 7 A - SOT23-6L; Manuf_1: ST; Ref St: 9153048; ECCN_US/EU: EAR99/NEC; Comments: exclusive with T5; Fitted: NO; Manuf_Part_1: STT7P2UH7; Order: STT7P2UH7; Distrib: ST; Provided: ST; Ordered by: ST
T7 = STS7P2UH7: STripFET VII Power MOSFET, P-CHANNEL 20V - 0.023 - 7A - SO-8; Manuf_Part_1: STS9P2UH7; Manuf_1: ST; Manuf_2: STM; Ref St: 9153052; ECCN_US/EU: EAR99/NEC; Comments: exclusive with T8; Order: STS9P2UH7; Distrib: ST; Provided: ST; Ordered by: ST; Manuf_Part_2: STS7P2UH7
T8 = STT7P2UH7: STripFET VII DeepGATE Power MOSFET, P-CHANNEL 20 V, 0.0146, 7 A - SOT23-6L; Manuf_1: ST; Ref St: 9153048; ECCN_US/EU: EAR99/NEC; Comments: exclusive with T7; Fitted: NO; Manuf_Part_1: STT7P2UH7; Order: STT7P2UH7; Distrib: ST; Provided: ST; Ordered by: ST
T9 = STS7P2UH7: STripFET VII Power MOSFET, P-CHANNEL 20V - 0.023 - 7A - SO-8; Manuf_Part_1: STS9P2UH7; Manuf_1: ST; Manuf_2: STM; Ref St: 9153052; ECCN_US/EU: EAR99/NEC; Comments: exclusive with T10; Order: STS9P2UH7; Distrib: ST; Provided: ST; Ordered by: ST; Manuf_Part_2: STS7P2UH7
T10 = STT7P2UH7: STripFET VII DeepGATE Power MOSFET, P-CHANNEL 20 V, 0.0146, 7 A - SOT23-6L; Manuf_1: ST; Ref St: 9153048; ECCN_US/EU: EAR99/NEC; Comments: exclusive with T9; Fitted: NO; Manuf_Part_1: STT7P2UH7; Order: STT7P2UH7; Distrib: ST; Provided: ST; Ordered by: ST
TP26 TP27 TP29 TP31 = TP: Ordered by: Subcon; Fitted: NO; ECCN_US/EU: n/a
U21 U23 = AOP-8PINS: Ordered by: ST; ECCN_US/EU: EAR99/NEC; Ref St: 9177443; Manuf_1: ST; Manuf_Part_1: TSZ122IST
U25 = MFX_V3: Multifunction expander; ECCN_US/EU: 3A991A2/NEC; Ordered by: ST; Ref St: 9175875; Manuf_1: ST; Manuf_Part_1: STM32L152CCT6